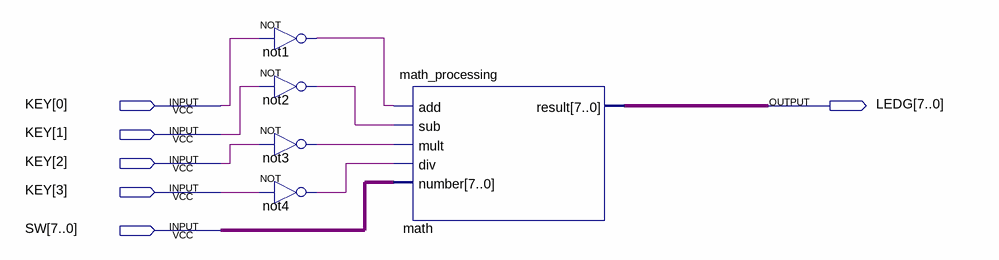
[diagram p0: schematic sheet]
// Quartus schematic calc.bdf as structural Verilog: 5 symbols, 6 pins
module calc (
  input  [3:0] KEY,
  input  [7:0] SW,
  output [7:0] LEDG
);

  wire not1_out, not2_out, not3_out, not4_out;

  not not1 (not1_out, KEY[0]);
  not not2 (not2_out, KEY[1]);
  not not3 (not3_out, KEY[2]);
  not not4 (not4_out, KEY[3]);
  math_processing math (.add(not1_out), .sub(not2_out), .mult(not3_out), .div(not4_out), .number(SW), .result(LEDG));
endmodule
